# Altium schematic sheet Boost.SchDoc
size A
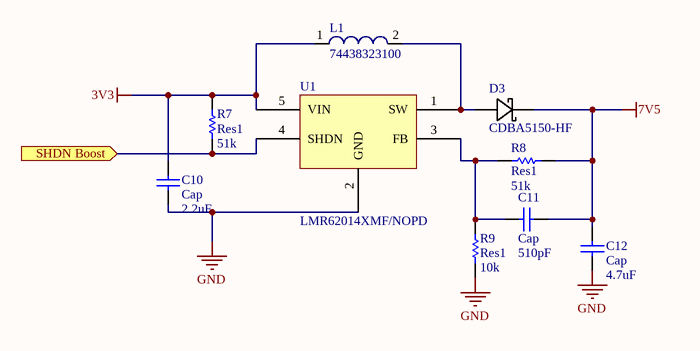
[diagram p0: Boost.SchDoc]

## Parts
C10  Cap  value 2.2uF  [1608[0603]]
C11  Cap  value 510pF  [6-0805_M]
C12  Cap  value 4.7uF  [6-0805_M]
D3  CDBA5150-HF  [CDBA5]
L1  74438323100  [SMD 2510]
R7  Res1  value 51k  [1608[0603]]
R8  Res1  value 51k  [1608[0603]]
R9  Res1  value 10k  [0402-A]
U1  LMR62014XMF/NOPD  [SOT95P280X145-5N]

## Ports
SHDN Boost (in)

## Nets
3V3: C10.2 L1.1 R7.1 U1.5(VIN)
7V5: C11.1 C12.2 D3.1 R8.2
GND: C10.1 C12.1 R9.2 U1.2(GND)
SHDN Boost: R7.2 U1.4(SHDN) ; port SHDN Boost
NetC11_2: C11.2 R8.1 R9.1 U1.3(FB)
NetD3_2: D3.2 L1.2 U1.1(SW)

## Library data of the parts
C10-C12 = Cap: Capacitor; Published: 8-Jun-2000; LatestRevisionDate: 17-Jul-2002; LatestRevisionNote: Re-released for DXP Platform.; PackageReference: RAD-0.3; Publisher: Altium Limited; PackageDescription: Radial Cap, Thru-Hole; 2 Leads; 0.3 in Pin Spacing
D3 = CDBA5150-HF: No Description Available; Vendor: Comchip; Built_By: EMA_UL_Team; SourceLibrary: ComchipTechnology_2015-04-20; Type: DEV; Manufacturer_Part_Number: CDBA5150-HF; Copyright: Copyright (C) 2018 Accelerated Designs. All rights reserved; RefDes: RefDes
L1 = CMP-1411-00017-1: Power Multilayer Inductor WE-MAPI, L=10.0µH; Manufacturer: Wuerth Elektronik; Inductance: 10.0ÂµH; PartNumber: 74438323100; ComponentLink1URL: http://www.we-online.com; ComponentLink2Description: Datasheet; ComponentLink1Description: Manufacturer URL; PackageReference: SMD 2510; ComponentLink2URL: http://katalog.we-online.de/kataloge/eisos/media/pdf/74438323100.pdf
R7-R9 = Res1: Resistor; Published: 8-Jun-2000; LatestRevisionDate: 17-Jul-2002; LatestRevisionNote: Re-released for DXP Platform.; PackageReference: AXIAL-0.3; Publisher: Altium Limited; PackageDescription: Axial Device, Thru-Hole; 2 Leads; 0.3 in Pin Spacing